# EAGLE design RoboBee_keypad (EAGLE 9.6.2)
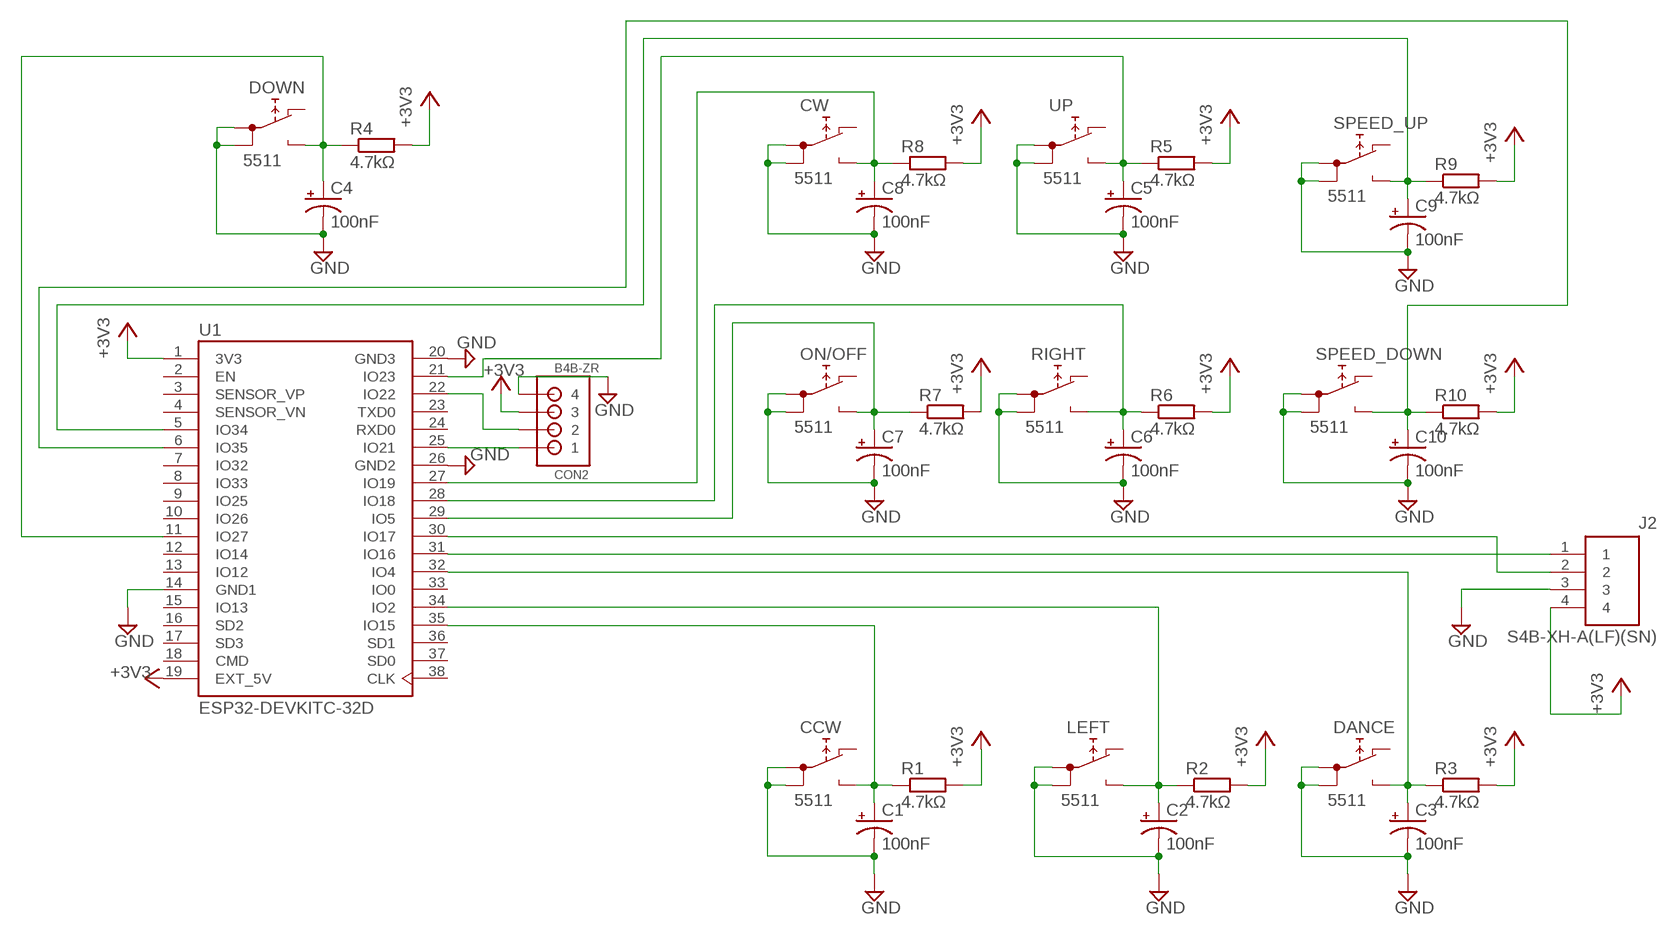
[diagram p0: schematic, sheet 1]

## Parts
C1  100nF  CPOL-USE1.8-4  [E1,8-4]
C2  100nF  CPOL-USE1.8-4  [E1,8-4]
C3  100nF  CPOL-USE1.8-4  [E1,8-4]
C4  100nF  CPOL-USE1.8-4  [E1,8-4]
C5  100nF  CPOL-USE1.8-4  [E1,8-4]
C6  100nF  CPOL-USE1.8-4  [E1,8-4]
C7  100nF  CPOL-USE1.8-4  [E1,8-4]
C8  100nF  CPOL-USE1.8-4  [E1,8-4]
C9  100nF  CPOL-USE1.8-4  [E1,8-4]
C10  100nF  CPOL-USE1.8-4  [E1,8-4]
CCW  5511  [5511]
CON2  B4B-ZR  [B4B-ZR]
CW  5511  [5511]
DANCE  5511  [5511]
DOWN  5511  [5511]
J2  S4B-XH-A(LF)(SN)  [HDR-04/RA]
LEFT  5511  [5511]
ON/OFF  5511  [5511]
R1  4.7kΩ  R-EU_0207/10  [0207/10]
R2  4.7kΩ  R-EU_0207/10  [0207/10]
R3  4.7kΩ  R-EU_0207/10  [0207/10]
R4  4.7kΩ  R-EU_0207/10  [0207/10]
R5  4.7kΩ  R-EU_0207/10  [0207/10]
R6  4.7kΩ  R-EU_0207/10  [0207/10]
R7  4.7kΩ  R-EU_0207/10  [0207/10]
R8  4.7kΩ  R-EU_0207/10  [0207/10]
R9  4.7kΩ  R-EU_0207/10  [0207/10]
R10  4.7kΩ  R-EU_0207/10  [0207/10]
RIGHT  5511  [5511]
SPEED_DOWN  5511  [5511]
SPEED_UP  5511  [5511]
U1  ESP32-DEVKITC-32D  [MODULE_ESP32-DEVKITC-32D]
UP  5511  [5511]

## Nets
+3V3: CON2.3 J2.4 R1.2 R2.2 R3.2 R4.2 R5.2 R6.2 R7.2 R8.2 R9.2 R10.2 U1.1(3V3) U1.19(EXT_5V)
GND: C1.- C2.- C3.- C4.- C5.- C6.- C7.- C8.- C9.- C10.- CCW.1A CCW.1B CON2.4 CW.1A CW.1B DANCE.1A DANCE.1B DOWN.1A DOWN.1B J2.3 LEFT.1A LEFT.1B ON/OFF.1A ON/OFF.1B RIGHT.1A RIGHT.1B SPEED_DOWN.1A SPEED_DOWN.1B SPEED_UP.1A SPEED_UP.1B U1.14(GND1) U1.20(GND3) U1.26(GND2) UP.1A UP.1B
N$1: C1.+ CCW.NO R1.1 U1.35(IO15)
N$2: C2.+ LEFT.NO R2.1 U1.34(IO2)
N$3: C3.+ DANCE.NO R3.1 U1.32(IO4)
N$4: C4.+ DOWN.NO R4.1 U1.11(IO27)
N$5: C5.+ R5.1 U1.21(IO23) UP.NO
N$6: C6.+ R6.1 RIGHT.NO U1.28(IO18)
N$7: C8.+ CW.NO R8.1 U1.27(IO19)
N$8: C7.+ ON/OFF.NO R7.1 U1.29(IO5)
N$9: C10.+ R10.1 SPEED_DOWN.NO U1.6(IO35)
N$10: CON2.1 U1.25(IO21)
N$11: J2.1 U1.31(IO16)
N$12: J2.2 U1.30(IO17)
N$13: CON2.2 U1.22(IO22)
N$14: C9.+ R9.1 SPEED_UP.NO U1.5(IO34)
Unconnected: CCW.NC CW.NC DANCE.NC DOWN.NC LEFT.NC ON/OFF.NC RIGHT.NC SPEED_DOWN.NC SPEED_UP.NC U1.2(EN) U1.3(SENSOR_VP) U1.4(SENSOR_VN) U1.7(IO32) U1.8(IO33) U1.9(IO25) U1.10(IO26) U1.12(IO14) U1.13(IO12) U1.15(IO13) U1.16(SD2) U1.17(SD3) U1.18(CMD) U1.23(TXD0) U1.24(RXD0) U1.33(IO0) U1.36(SD1) U1.37(SD0) U1.38(CLK) UP.NC

## Library data of the parts
C1-C10 = rcl:CPOL-US: POLARIZED CAPACITOR, American symbol; SPICEPREFIX: C
CCW CW DANCE DOWN LEFT ON/OFF RIGHT SPEED_DOWN SPEED_UP UP = switch:55?: PUSHBUTTON SERIES 5500 SWITCHES Source: www.e-switch.com .. 5500.pdf
CON2 = jst:B4B-ZR: oled SSD1315 display 4 pol, 1.5mm pitch Package: B4B-ZR Source: Datasheet <https://wiki.seeedstudio.com/Grove-OLED-Display-0.96-SSD1315>
J2 = Connectors:S4B-XH-A(LF)(SN): CONN HEADER R/A 4POS 2.5MM Manufacturer's datasheet <http://www.jst-mfg.com/product/pdf/eng/eXH.pdf>; CREATED_BY: PCBLayout.com; DIGIKEY_PART_NUMBER: 455-2243-ND; MANUFACTURER: JST Sales America Inc.; MPN: S4B-XH-A(LF)(SN)
R1-R10 = rcl:R-EU_: RESISTOR, European symbol; SPICEPREFIX: R
U1 = ESP32-DEVKITC-32D:ESP32-DEVKITC-32D: Eval Board For Esp-Wroom-32 Check availability <https://pricing.snapeda.com/parts/ESP32-DEVKITC-32D/Espressif%20Systems/view-part?ref=eda>; AVAILABILITY: In Stock; DESCRIPTION: WiFi Development Tools (802.11) ESP32 General Development Kit, ESP32-WROOM-32D on the board; MF: Espressif Systems; MP: ESP32-DEVKITC-32D; PACKAGE: None; PRICE: None; PURCHASE-URL: https://pricing.snapeda.com/search/part/ESP32-DEVKITC-32D/?ref=eda

## Board
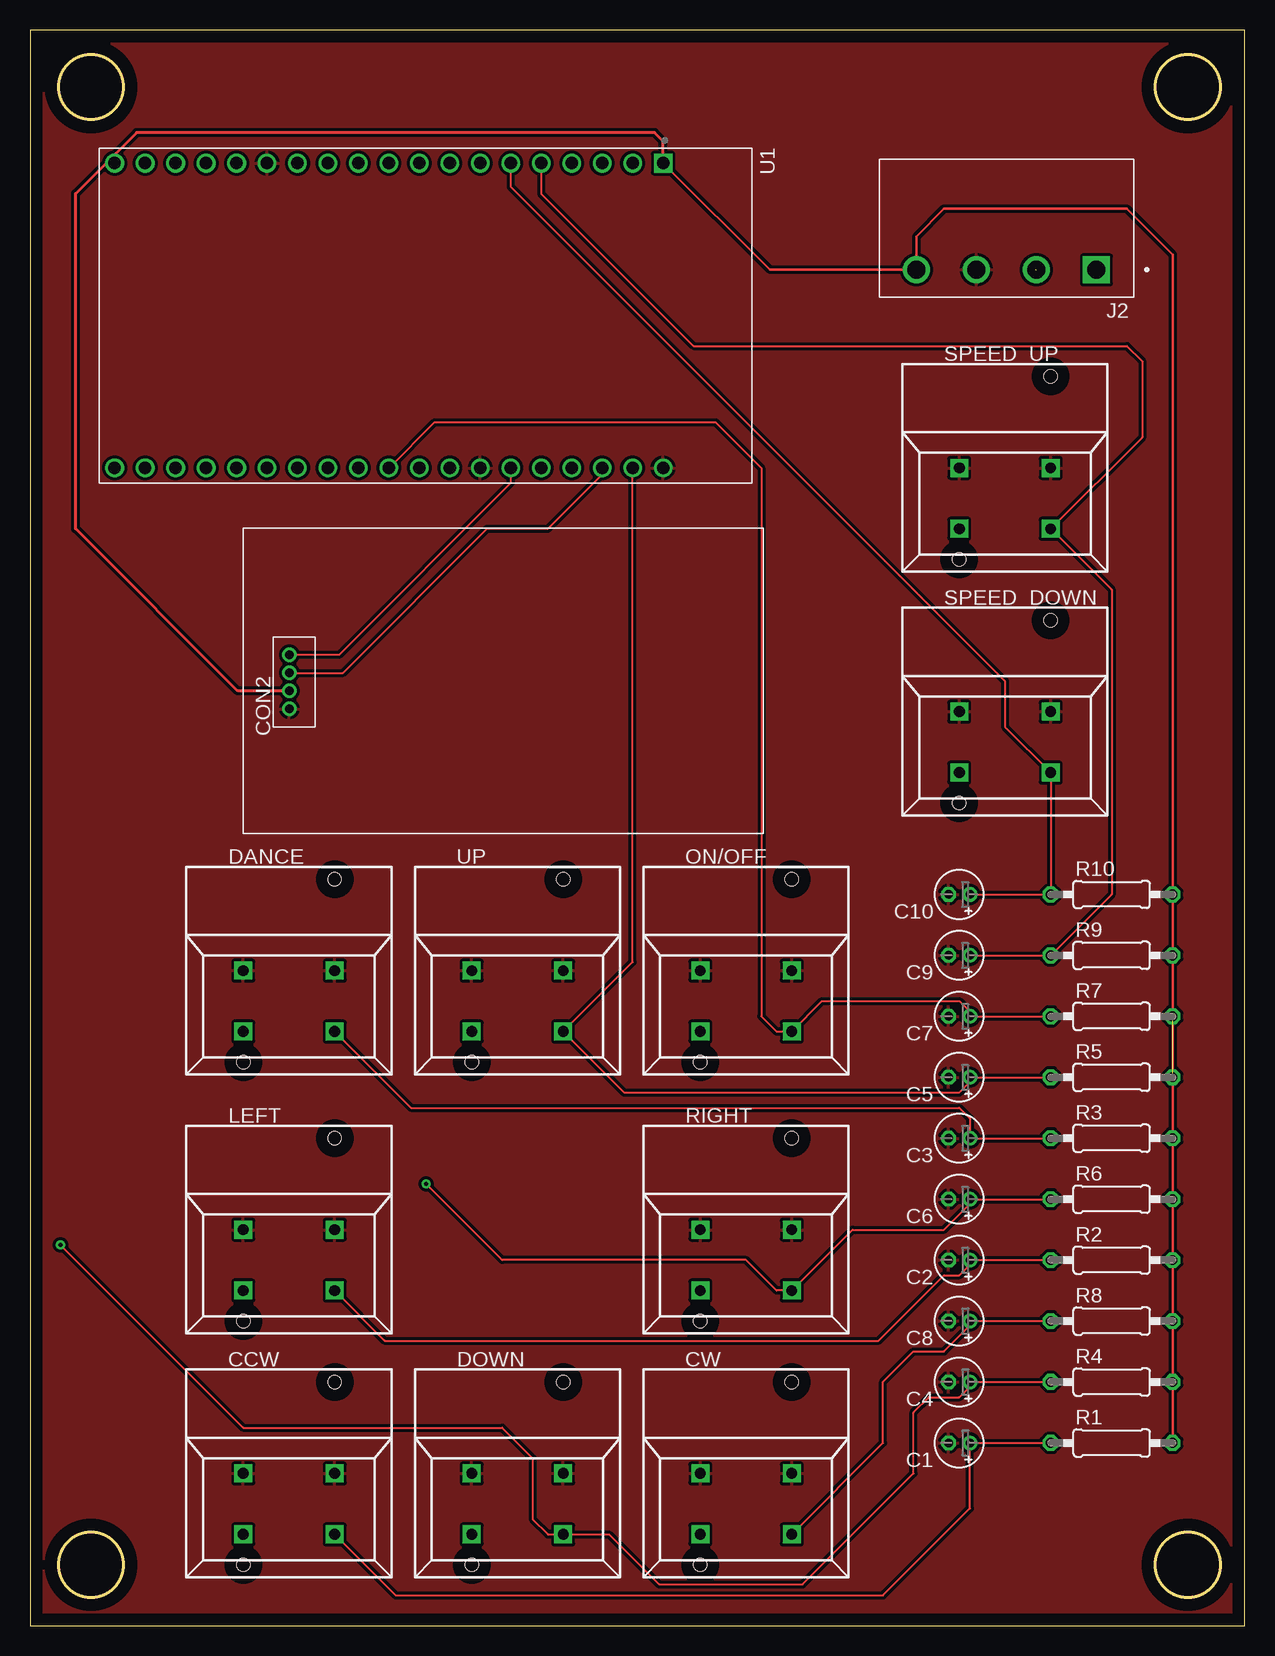
[diagram p1: board, top side]
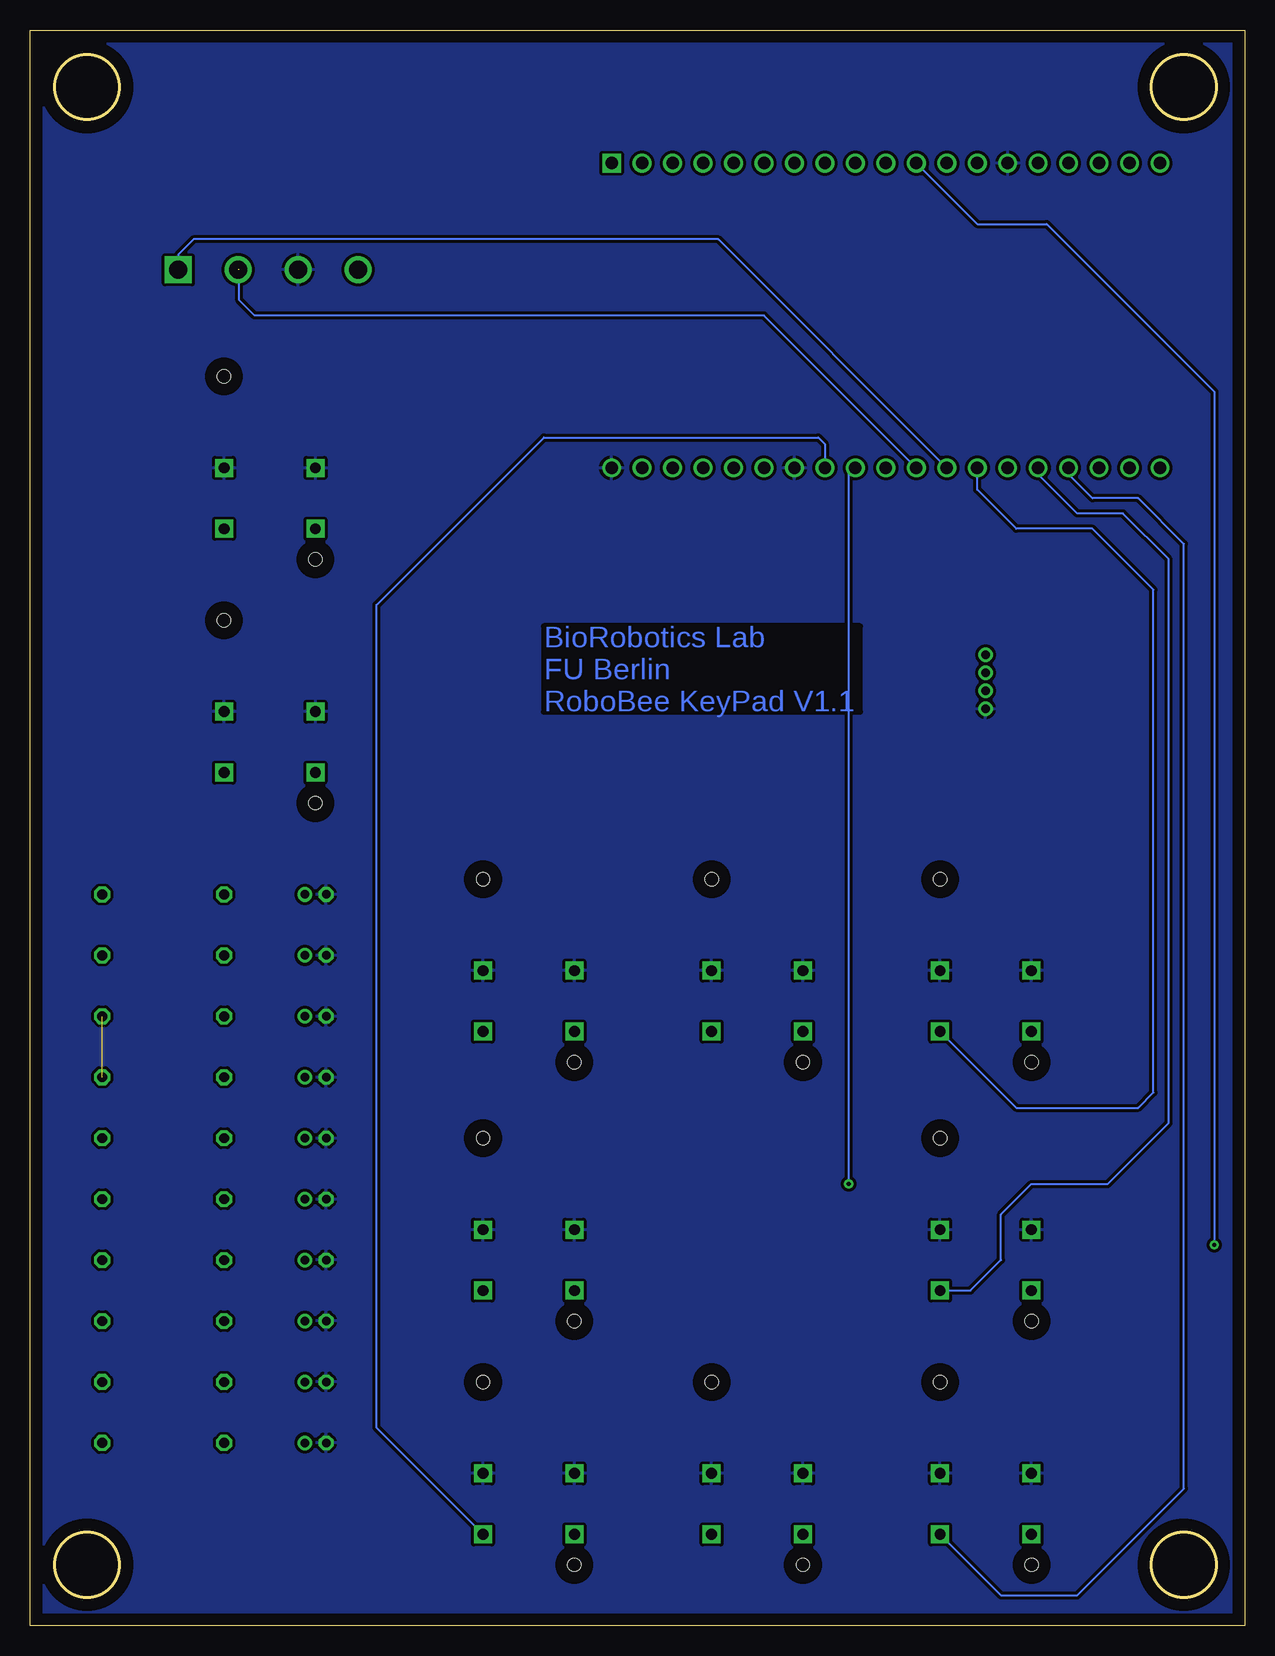
[diagram p2: board, bottom side, seen from below]

Size 101.27 x 133.02 mm. Coordinates in mm from the lower left corner, seen from the top.
Outline: 0,0 101.27,0 101.27,133.02 0,133.02 0,0
Outline: circle at 5.08,128.27 radius 2.7
Outline: circle at 96.52,128.27 radius 2.7
Outline: circle at 96.52,5.08 radius 2.7
Outline: circle at 5.08,5.08 radius 2.7
Copper layers (1*16): Top 0.035mm / dielectric 1.5mm / Bottom 0.035mm
Design rules "default": minimum track width 6mil, minimum drill 0.35mm, track to track 6mil, track to pad 6mil, pad to pad 6mil, via to via 6mil, smd to smd 6mil, copper to edge 40mil, drill to drill 6mil, minimum pad ring 10mil, minimum via ring 8mil, stop-mask expansion 4mil, vias tented up to drill 0mil, thermal gap 10mil

### Footprints (pad centres in the part's own frame; a part is rotated, then mirrored left to right if it is on the bottom)
E1,8-4 = drill 0.711 pad 1.168: + -0.889,0 | drill 0.711 pad 1.168 octagon: - 0.889,0
5511 = drill 0.9 pad 1.5 square: 1A 0,3.81; 1B 0,-3.81; NC 5.08,-3.81; NO 5.08,3.81 | hole 1.1: -7.62,3.81; 7.62,-3.81
B4B-ZR = drill 0.7: 1 14.89,39.34; 2 13.39,39.34; 3 11.89,39.34; 4 10.39,39.34
HDR-04/RA = drill 1.5 square: 1 0,0 | drill 1.5: 2 5,0; 3 10,0; 4 15,0
0207/10 = drill 0.813 octagon: 1 -5.08,0; 2 5.08,0
MODULE_ESP32-DEVKITC-32D = drill 1.04 square: 1 -12.7,19.76 | drill 1.04: 2 -12.7,17.22; 3 -12.7,14.68; 4 -12.7,12.14; 5 -12.7,9.6; 6 -12.7,7.06; 7 -12.7,4.52; 8 -12.7,1.98; 9 -12.7,-0.56; 10 -12.7,-3.1; 11 -12.7,-5.64; 12 -12.7,-8.18; 13 -12.7,-10.72; 14 -12.7,-13.26; 15 -12.7,-15.8; 16 -12.7,-18.34; 17 -12.7,-20.88; 18 -12.7,-23.42; 19 -12.7,-25.96; 20 12.7,19.76; 21 12.7,17.22; 22 12.7,14.68; 23 12.7,12.14; 24 12.7,9.6; 25 12.7,7.06; 26 12.7,4.52; 27 12.7,1.98; 28 12.7,-0.56; 29 12.7,-3.1; 30 12.7,-5.64; 31 12.7,-8.18; 32 12.7,-10.72; 33 12.7,-13.26; 34 12.7,-15.8; 35 12.7,-18.34; 36 12.7,-20.88; 37 12.7,-23.42; 38 12.7,-25.96

### Placement (x,y rotation side)
C1  77.47,15.24 180 top
C2  77.47,30.48 180 top
C3  77.47,40.64 180 top
C4  77.47,20.32 180 top
C5  77.47,45.72 180 top
C6  77.47,35.56 180 top
C7  77.47,50.8 180 top
C8  77.47,25.4 180 top
C9  77.47,55.88 180 top
C10  77.47,60.96 180 top
CCW  21.59,12.7 270 top
CON2  60.96,66.04 90 top
CW  59.69,12.7 270 top
DANCE  21.59,54.61 270 top
DOWN  40.64,12.7 270 top
J2  88.9,113.03 180 top
LEFT  21.59,33.02 270 top
ON/OFF  59.69,54.61 270 top
R1  90.17,15.24 0 top
R2  90.17,30.48 0 top
R3  90.17,40.64 0 top
R4  90.17,20.32 0 top
R5  90.17,45.72 0 top
R6  90.17,35.56 0 top
R7  90.17,50.8 0 top
R8  90.17,25.4 0 top
R9  90.17,55.88 0 top
R10  90.17,60.96 0 top
RIGHT  59.69,33.02 270 top
SPEED_DOWN  81.28,76.2 270 top
SPEED_UP  81.28,96.52 270 top
U1  33.02,109.22 270 top
UP  40.64,54.61 270 top

### Tracks (layer width: path | path; a pad name or v marks a point on that pad's centre or on a via)
+3V3  (1 unrouted)
  Top 0.203: U1.1 61.67,113.03 J2.4 73.9,115.81 76.2,118.11 91.44,118.11 95.25,114.3 R10.2 R9.2 R5.2 R3.2 R6.2 R2.2 R8.2 R4.2 R1.2
  Top 0.254: U1.1 52.78,123.75 52.07,124.46 8.89,124.46 7.06,122.63 U1.19 6.35,121.92 3.81,119.38 3.81,91.44 17.32,77.93 CON2.3
GND
  pour Top (isolate 0.254): 0,133.35 101.6,133.35 101.6,0 0,0
  pour Bottom (isolate 0.254): 0,133.35 101.6,133.35 101.6,0 0,0
N$1
  Top 0.152: R1.1 C1.+ 78.36,9.78 71.12,2.54 30.48,2.54 CCW.NO
  Bottom 0.152: CCW.NO 20.32,2.54 13.97,2.54 5.08,11.43 5.08,90.17 8.89,93.98 12.7,93.98 14.68,95.96 U1.35
N$2
  Top 0.152: C2.+ 78.74,30.48 | 78.74,30.48 R2.1 | LEFT.NO 29.58,23.76 70.75,23.76 76.2,29.21 77.47,29.21 78.74,30.48
  Bottom 0.152: LEFT.NO 22.86,27.94 20.32,30.48 20.32,34.29 17.78,36.83 11.43,36.83 6.35,41.91 6.35,88.9 10.16,92.71 13.97,92.71 17.22,95.96 U1.34
N$3
  Top 0.152: R3.1 C3.+ 78.36,42.29 77.47,43.18 31.75,43.18 DANCE.NO
  Bottom 0.152: U1.32 22.3,94.69 19.05,91.44 12.7,91.44 7.62,86.36 7.62,44.45 8.89,43.18 19.05,43.18 DANCE.NO
N$4  (via drill 0.35)
  Top 0.152: C4.+ 78.74,20.32 | 78.74,20.32 R4.1 | 78.74,20.32 77.47,19.05 74.93,19.05 73.66,17.78 73.66,12.7 64.4,3.44 52.44,3.44 48.26,7.62 DOWN.NO 43.18,7.62 41.91,8.89 41.91,13.97 39.37,16.51 17.78,16.51 v2.54,31.75
  Bottom 0.152: U1.11 22.3,116.84 16.51,116.84 2.54,102.87 v2.54,31.75
N$5
  Top 0.152: C5.+ 78.74,45.72 | 78.74,45.72 R5.1 | 78.74,45.72 77.47,44.45 49.53,44.45 UP.NO 50.24,55.32 U1.21
N$6  (via drill 0.35)
  Top 0.152: C6.+ 78.74,35.56 | 78.74,35.56 R6.1 | 78.74,35.56 76.2,33.02 68.58,33.02 RIGHT.NO 62.23,27.94 59.69,30.48 39.37,30.48 v33.02,36.83
  Bottom 0.152: v33.02,36.83 33.02,95.96 U1.28
N$7
  Top 0.152: C8.+ 78.74,25.4 | 78.74,25.4 R8.1 | CW.NO 71.12,15.24 71.12,20.32 73.66,22.86 76.2,22.86 78.74,25.4
  Bottom 0.152: CW.NO 72.39,16.51 72.39,85.09 58.42,99.06 35.56,99.06 35,98.5 U1.27
N$8  (via drill 0.35)
  Top 0.152: C7.+ 78.74,50.8 | 78.74,50.8 R7.1 | 78.74,50.8 77.47,52.07 66.04,52.07 ON/OFF.NO 62.23,49.53 60.96,50.8 60.96,96.52 57.15,100.33 33.73,100.33 U1.29
  other vias: 29.92,96.52
N$9
  Top 0.152: C10.+ R10.1 SPEED_DOWN.NO 81.28,74.93 81.28,78.74 40.08,119.94 U1.6
N$10
  Top 0.152: U1.25 40.08,95.25 25.76,80.93 CON2.1
N$11
  Bottom 0.152: U1.31 43.89,115.57 87.63,115.57 88.9,114.3 J2.1
N$12  (1 unrouted)
  Bottom 0.152: U1.30 40.08,109.22 82.55,109.22 83.82,110.49 83.82,113.03
N$13
  Top 0.152: CON2.2 26.09,79.43 38.1,91.44 43.18,91.44 47.7,95.96 U1.22
N$14
  Top 0.152: C9.+ R9.1 90.17,60.96 90.17,86.36 SPEED_UP.NO 92.71,99.06 92.71,105.41 91.44,106.68 55.32,106.68 42.62,119.38 U1.5

### Text on the board
Bottom: BioRobotics Lab / FU Berlin / RoboBee KeyPad V1.1